# Altium schematic sheet REO_channel.SchDoc
size 420 x 297 mm; SheetNumber: 1; SheetTotal: 5
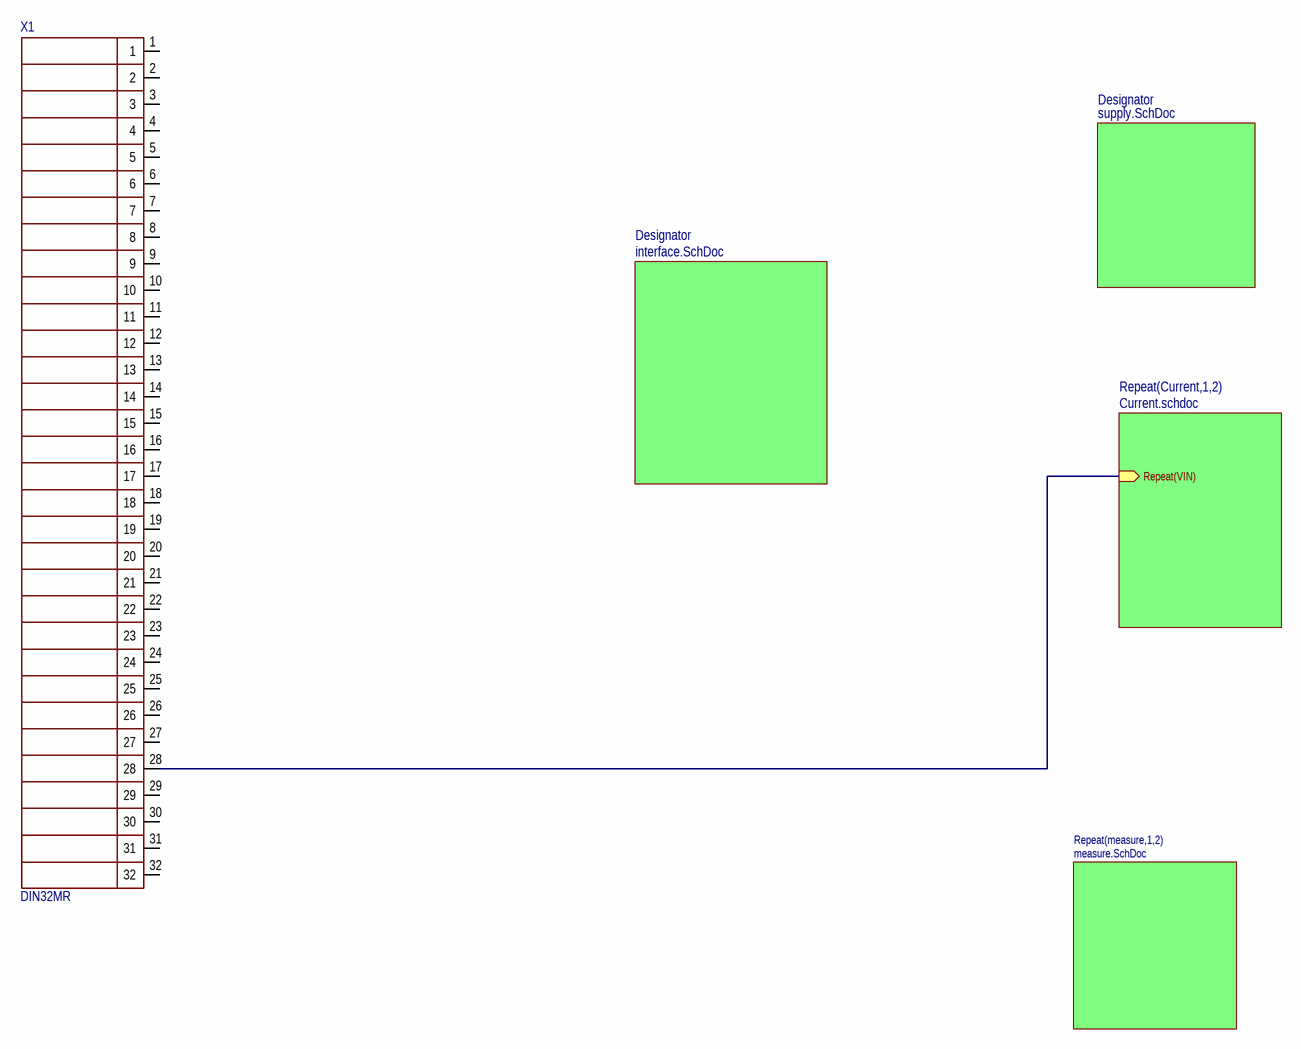
[diagram p0: REO_channel.SchDoc]

## Parts
X1  DIN32MR  [DIN 2x16 32MR]

## Sub-sheets
Designator = supply.SchDoc: no entries
Designator = interface.SchDoc: no entries
Repeat(Current,1,2) = Current.schdoc: Repeat(VIN) (in)
Repeat(measure,1,2) = measure.SchDoc: no entries

## Nets
NetX1_28: X1.28 ; sheet Repeat(Current,1,2)/Repeat(VIN)

Not connected (* = marked no-connect by the designer): X1 1 2 3 4 5 6 7 8 9 10 11 12 13 14 15 16 17 18 19 20 21 22 23 24 25 26 27 29 30 31 32

## Notes on the sheet
- Перв. примен.
- 3707.00000000 ЭИТ-1
- Справ. №
- Подп. и дата
- Инв. № дубл.
- Взам. инв. №
- Разраб.
- Изм.
- Лист
- № докум.
- Подп.
- Дата
- Лит.
- Масса
- Масштаб
- Пров.
- Т.контр.
- *
- Листов
- Инв. № подл.
- Утв.
- Н.контр.
- 2.106-A3
- Копировал
- Формат А3

## Library data of the parts
X1 = DIN 2x16 32MR